# Altium schematic sheet Current_Draw_Circuit.SchDoc: Current Draw Sensor
size A4
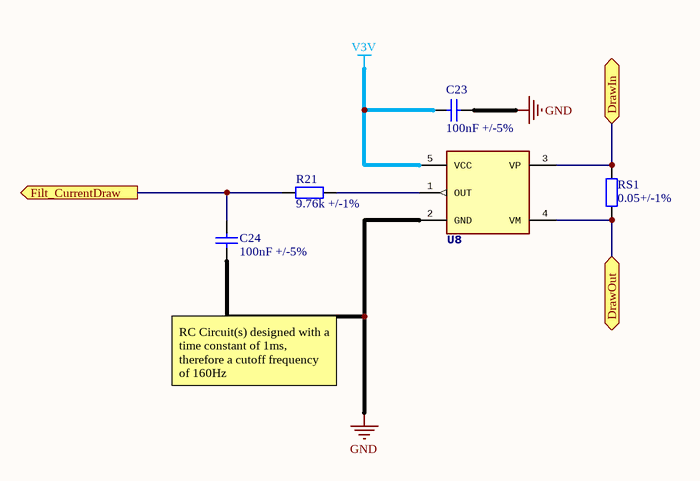
[diagram p0: Current_Draw_Circuit.SchDoc]

## Parts
C23  value 100nF +/-5%  [CAPC1608X06N (0603)]  (hidden comment: Cap Semi)
C24  value 100nF +/-5%  [CAPC1608X06N (0603)]  (hidden comment: Cap Semi)
R21  value 9.76k +/-1%  [RESC1608X06N (0603)]  (hidden comment: Res)
RS1  value 0.05+/-1%  [RESC2012X06N (0805)]  (hidden comment: Res)
U8  CS30xL  [SOT95P280X145-5N]  (value not drawn)

## Ports
DrawIn, DrawOut, Filt_CurrentDraw (out)

## Nets
GND: C23.1 C24.1 U8.2(GND)
V3V: C23.2 U8.5(VCC)
DrawIn: RS1.2 U8.3(VP) ; port DrawIn
DrawOut: RS1.1 U8.4(VM) ; port DrawOut
Filt_CurrentDraw: C24.2 R21.1 ; port Filt_CurrentDraw
NetR21_2: R21.2 U8.1(OUT)

## Notes on the sheet
- RC Circuit(s) designed with a time constant of 1ms, therefore a cutoff frequency of 160Hz
- Title
- Size:
- Date:
- A4
- Number:
- Time:
- Revision:
- Sheet
- of
- File:

## Library data of the parts
C23 C24 = Cap Semi: Capacitor (Semiconductor SIM Model); Published: 8-Jun-2000; LatestRevisionDate: 29-May-2009; LatestRevisionNote: IPC-7351 Footprint Added.; PackageReference: X7R; Publisher: Altium Limited; PackageDescription: Chip Capacitor
R21 RS1 = Res: Resistor; Published: 8-Jun-2000; LatestRevisionDate: 17-Jul-2002; LatestRevisionNote: Re-released for DXP Platform.; PackageReference: MCWR06; Publisher: Altium Limited; PackageDescription: SMD Chip Resistor
U8 = CS30xL: High side current sense high voltage op amp; Manufacturer_Name: STMicroelectronics; Allied_Number: 70602615; Manufacturer_Part_Number: CS30xL; Mouser_Part_Number: 511-CS30xL; Mouser_Price-Stock: https://www.mouser.com/Search/Refine.aspx?Keyword=511-CS30BL; RS_Part_Number: 8607514; RS_Price-Stock: https://uk.rs-online.com/web/p/products/8607514; Allied_Price-Stock: http://www.alliedelec.com/stmicroelectronics-cs30bl/70602615/; Height: 1.45mm